# EAGLE schematic APPS1 (EAGLE 9.6.2)
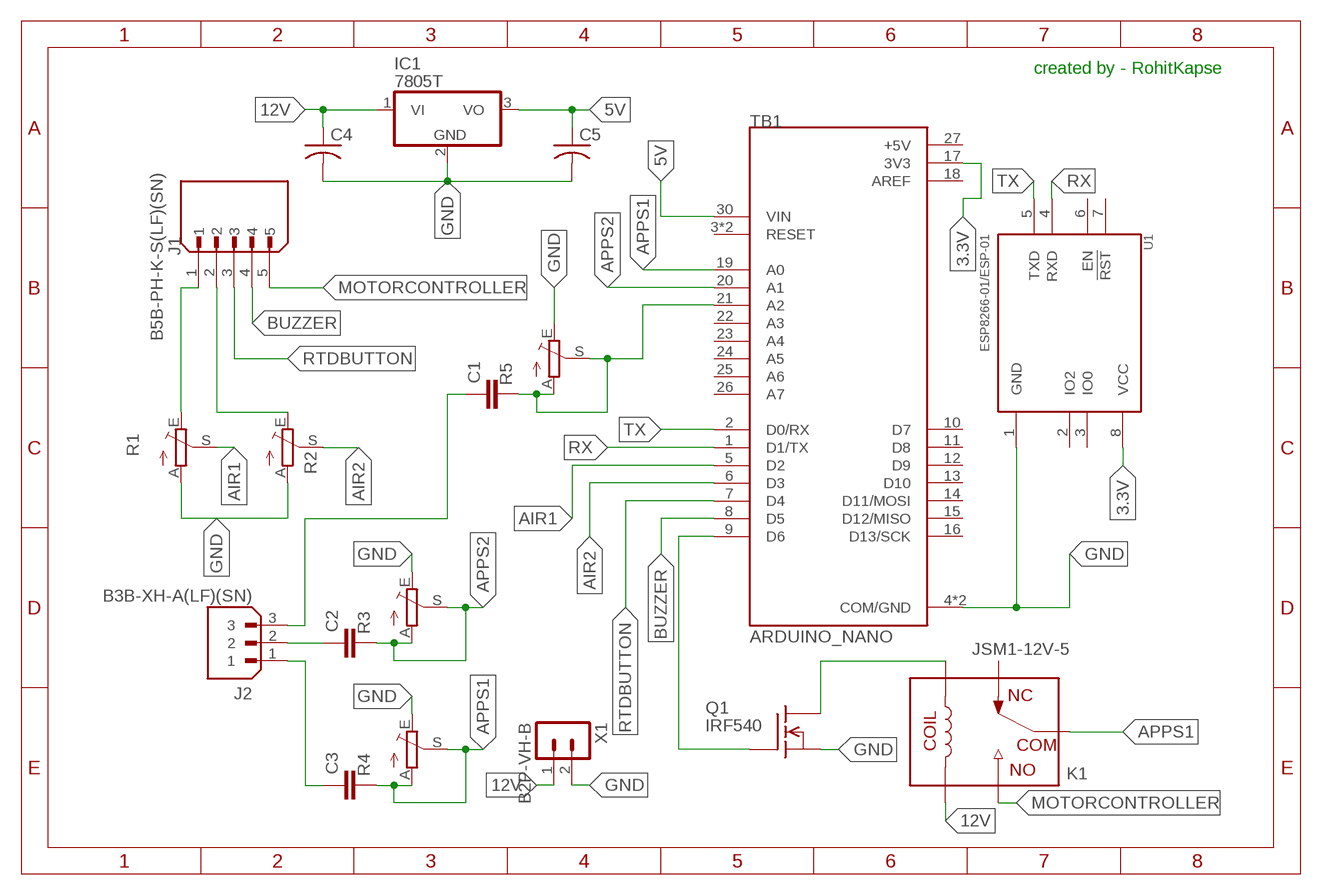
[diagram p0: schematic, sheet 1]

## Parts
C1  C-EU025-025X050  [C025-025X050]
C2  C-EU025-025X050  [C025-025X050]
C3  C-EU025-025X050  [C025-025X050]
C4  C-US025-025X050  [C025-025X050]
C5  C-US025-025X050  [C025-025X050]
IC1  7805T  [TO220H]
J1  B5B-PH-K-S(LF)(SN)  [JST_B5B-PH-K-S(LF)(SN)]
J2  B3B-XH-A(LF)(SN)  [JST_B3B-XH-A(LF)(SN)]
K1  JSM1-12V-5  [JSM1-12V-5]
Q1  IRF540  [TO220]
R1  TRIM_EU-S64W  [S64W]
R2  TRIM_EU-S64W  [S64W]
R3  TRIM_EU-S64W  [S64W]
R4  TRIM_EU-S64W  [S64W]
R5  TRIM_EU-S64W  [S64W]
TB1  ARDUINO_NANO  [SHIELD_ARDUINO_NANO]
U1  ESP8266-01/ESP-01  [XCVR_ESP8266-01/ESP-01]
X1  B2P-VH-B  [B2P-VH]

## Nets
3.3V: TB1.17(3V3) U1.8(VCC)
5V: C5.1 IC1.3(VO) TB1.30(VIN)
12V: C4.1 IC1.1(VI) K1.2 X1.1
AIR1: R1.S TB1.5(D2)
AIR2: R2.S TB1.6(D3)
APPS1: C3.2 K1.1 R4.A R4.S TB1.19(A0)
APPS2: C2.2 R3.A R3.S TB1.20(A1)
BPS: C1.2 R5.A R5.S TB1.21(A2)
BUZZER: J1.4 TB1.8(D5)
GND: C4.2 C5.2 IC1.2(GND) Q1.3(S) R1.A R2.A R3.E R4.E R5.E TB1.4(COM/GND) TB1.29(COM/GND) U1.1(GND) X1.2
MOTORCONTROLLER: J1.5 K1.3 Q1.1(G) TB1.9(D6)
N$1: J1.1 R1.E
N$2: C2.1 J2.2
N$3: K1.5 Q1.2(D)
N$4: J1.2 R2.E
N$5: C3.1 J2.1
N$6: C1.1 J2.3
RTDBUTTON: J1.3 TB1.7(D4)
RX: TB1.1(D1/TX) U1.4(RXD)
TX: TB1.2(D0/RX) U1.5(TXD)
Unconnected: K1.4 TB1.3(RESET) TB1.10(D7) TB1.11(D8) TB1.12(D9) TB1.13(D10) TB1.14(D11/MOSI) TB1.15(D12/MISO) TB1.16(D13/SCK) TB1.22(A3) TB1.23(A4) TB1.24(A5) TB1.25(A6) TB1.26(A7) TB1.28(RESET) U1.2(IO2) U1.3(IO0) U1.6(EN) U1.7(!RST)

## Notes on the sheet
- created by - RohitKapse

## Power pins joined to a net without a drawn wire
+5V: TB1.27(+5V)
AREF: TB1.18(AREF)

## Library data of the parts
C1-C3 = ALL IMP LIB:C-EU: CAPACITOR, European symbol
C4 C5 = adafruit:C-US: CAPACITOR, American symbol
IC1 = adafruit:78*: Positive VOLTAGE REGULATOR Added bigger pads to the TO-92 package
J1 = jst-5pin:B5B-PH-K-S(LF)(SN): Check availability <https://pricing.snapeda.com/parts/B5B-PH-K-S%28LF%29%28SN%29/JST%20Sales/view-part?ref=eda>; AVAILABILITY: In Stock; CHECK_PRICES: https://www.snapeda.com/parts/B5B-PH-K-S(LF)(SN)/JST+Sales+America+Inc/view-part/?ref=eda; DESCRIPTION: Connector Header Through Hole 5 position 0.079 (2.00mm); MF: JST Sales; MP: B5B-PH-K-S(LF)(SN); PACKAGE: None; PRICE: None; SNAPEDA_LINK: https://www.snapeda.com/parts/B5B-PH-K-S(LF)(SN)/JST+Sales+America+Inc/view-part/?ref=snap
J2 = B3B-XH-A_LF__SN_:B3B-XH-A(LF)(SN): Check availability <https://pricing.snapeda.com/parts/B3B-XH-A%28LF%29%28SN%29/JST%20Sales/view-part?ref=eda>; AVAILABILITY: In Stock; CHECK_PRICES: https://www.snapeda.com/parts/B3B-XH-A(LF)(SN)/JST+Sales+America+Inc./view-part/?ref=eda; DESCRIPTION: Connector Header Through Hole 3 position 0.098 (2.50mm); MF: JST Sales; MP: B3B-XH-A(LF)(SN); PACKAGE: None; PRICE: None; SNAPEDA_LINK: https://www.snapeda.com/parts/B3B-XH-A(LF)(SN)/JST+Sales+America+Inc./view-part/?ref=snap
K1 = Relay:JSM1-12V-5: RELAY AUTOMOTIVE SPDT 15A 12V Manufacturer's datasheet <https://media.digikey.com/pdf/Data%20Sheets/Panasonic%20Electric%20Works%20PDFs/JS-M_Series_Rev_Dec_2011.pdf>; CREATED_BY: PCBLayout.com; DIGIKEY_PARTNO: 255-1240-ND; MANUFACTURER: Panasonic Electric Works; MPN: JSM1-12V-5
Q1 = transistor-fet:IRF540: N-Channel Enhancement MOSFET (HEXFET); 100V; 28A; 0,077Ohm
R1-R5 = ALL IMP LIB:TRIM_EU-: POTENTIOMETER
TB1 = ARDUINO_NANO (1):ARDUINO_NANO: Arduino Nano, Through Hole Check availability <https://pricing.snapeda.com/parts/Arduino%20Nano/Arduino/view-part?ref=eda>; AVAILABILITY: Not in stock; CHECK_PRICES: https://www.snapeda.com/parts/Arduino%20Nano/Arduino/view-part/?ref=eda; DESCRIPTION: Small, complete, and breadboard-friendly board based on the ATmega328 (Arduino Nano 3.x); MF: Arduino; MP: Arduino Nano; PACKAGE: Non-Standard Arduino; PRICE: None; SNAPEDA_LINK: https://www.snapeda.com/parts/Arduino%20Nano/Arduino/view-part/?ref=snap
U1 = ESP8266-01_ESP-01:ESP8266-01/ESP-01: MakerFocus 4pcs ESP8266 ESP-01 Serial Wireless WiFi Transceiver Receiver Module 1MB SPI Flash DC3.0-3.6V Internet of Things WiFi Module Board Compatible with Ar duino Check availability <https://pricing.snapeda.com/parts/ESP8266-01/ESP-01/AI-Thinker/view-part?ref=eda>; AVAILABILITY: Not in stock; CHECK_PRICES: https://www.snapeda.com/parts/ESP8266-01/ESP-01/AI-Thinker/view-part/?ref=eda; DESCRIPTION: MakerFocus 4pcs ESP8266 ESP-01 Serial Wireless WiFi Transceiver Receiver Module 1MB SPI Flash DC3.0-3.6V Internet of Things WiFi Module Board Compatible with Ar duino; MF: AI-Thinker; MP: ESP8266-01/ESP-01; PACKAGE: Non-Standard AI-Thinker; PRICE: None; SNAPEDA_LINK: https://www.snapeda.com/parts/ESP8266-01/ESP-01/AI-Thinker/view-part/?ref=snap
X1 = jst-2pin:B2P-VH: JST VH Series header 3.96mm pitch disconnectable crimp style connectors, vertical (side entry type), 2 pins Check availability <https://pricing.snapeda.com/parts/B2P-VH/JST%20Sales%20America%20Inc./view-part?ref=eda>; AVAILABILITY: In Stock; CHECK_PRICES: https://www.snapeda.com/parts/B2P-VH/JST+Sales+America+Inc./view-part/?ref=eda; DESCRIPTION: 2 Position Adapter Connector Receptacle, Female Sockets To Receptacle, Female Sockets 0.156 (3.96mm); MF: JST Sales America Inc.; MP: B2P-VH; PACKAGE: None; PRICE: None; SNAPEDA_LINK: https://www.snapeda.com/parts/B2P-VH/JST+Sales+America+Inc./view-part/?ref=snap